# EAGLE design Aerospark v0.0 (EAGLE 6.6.0)
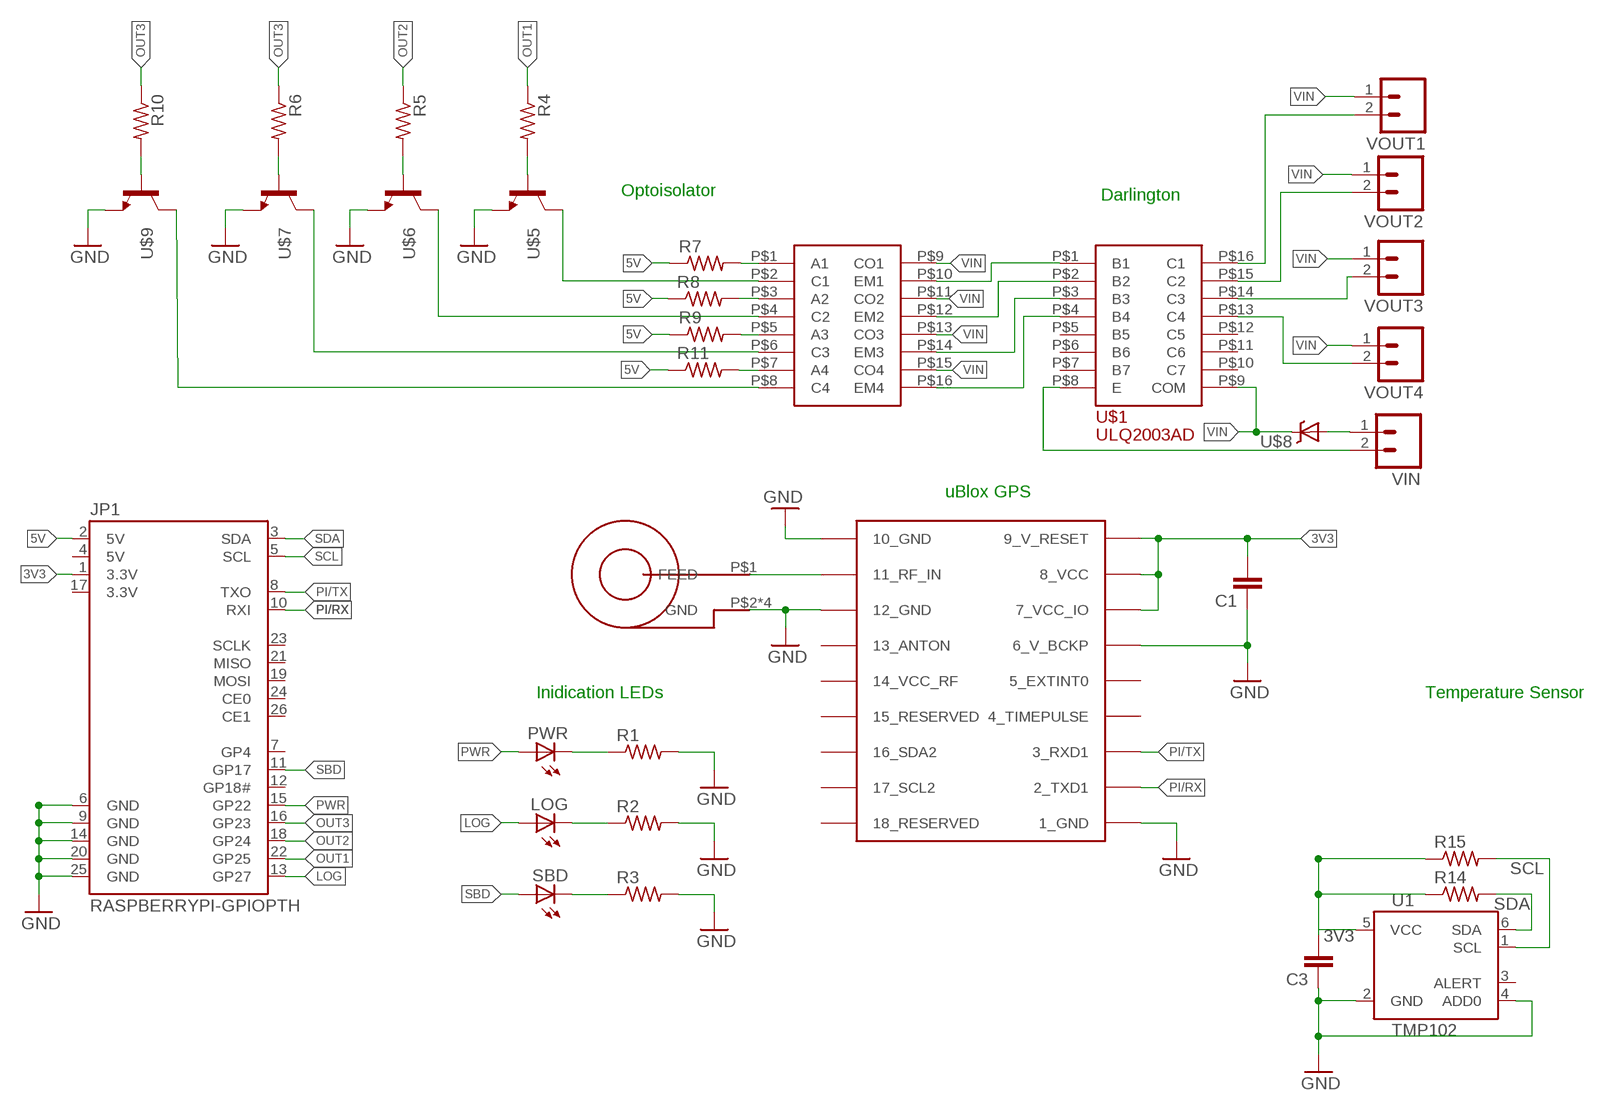
[diagram p0: schematic, sheet 1]

## Parts
C1  CAP0805  [0805]
C3  CAP0805  [0805]
JP1  RASPBERRYPI-GPIOPTH  [2X13-SHROUDED]
LOG  LEDCHIPLED_0805  [CHIPLED_0805]
PWR  LEDCHIPLED_0805  [CHIPLED_0805]
R1  R-US_R0805  [R0805]
R2  R-US_R0805  [R0805]
R3  R-US_R0805  [R0805]
R4  R-US_R0805  [R0805]
R5  R-US_R0805  [R0805]
R6  R-US_R0805  [R0805]
R7  R-US_R0805  [R0805]
R8  R-US_R0805  [R0805]
R9  R-US_R0805  [R0805]
R10  R-US_R0805  [R0805]
R11  R-US_R0805  [R0805]
R14  R-US_R0805  [R0805]
R15  R-US_R0805  [R0805]
SBD  LEDCHIPLED_0805  [CHIPLED_0805]
U1  TMP102  [SOT563]
U$1  ULQ2003A  [SOIC]
U$2  UBLOX_MAX  [UBLOX_MAX]
U$3  JDGA-REMQV-ANTENNA  [JDGA-RIGID_COMBO_PAD]
U$5  MMBT3904FSCT-ND  [SOT-23]
U$6  MMBT3904FSCT-ND  [SOT-23]
U$7  MMBT3904FSCT-ND  [SOT-23]
U$8  VISHAY_SCHOTTKY  [DO-220AA]
U$9  MMBT3904FSCT-ND  [SOT-23]
U$11  K847PH  K847PHDIP16  [DIP16]
VIN  M023.5MM_LOCK  [SCREWTERMINAL-3.5MM-2_LOCK]
VOUT1  M023.5MM_LOCK  [SCREWTERMINAL-3.5MM-2_LOCK]
VOUT2  M023.5MM_LOCK  [SCREWTERMINAL-3.5MM-2_LOCK]
VOUT3  M023.5MM_LOCK  [SCREWTERMINAL-3.5MM-2_LOCK]
VOUT4  M023.5MM_LOCK  [SCREWTERMINAL-3.5MM-2_LOCK]

## Nets
3V3: C1.2 C3.2 JP1.1(3.3V) R14.1 R15.1 U1.5(VCC) U$2.7_VCC_IO U$2.8_VCC U$2.9_V_RESET
5V: JP1.2(5V) R7.1 R8.1 R9.1 R11.1
GND: C1.1 C3.1 JP1.6(GND) JP1.9(GND) JP1.14(GND) JP1.20(GND) JP1.25(GND) R1.2 R2.2 R3.2 U1.2(GND) U1.4(ADD0) U$2.1_GND U$2.6_V_BCKP U$2.10_GND U$2.12_GND U$3.P$2(GND) U$3.P$3(GND) U$3.P$4(GND) U$3.P$5(GND) U$5.3(E) U$6.3(E) U$7.3(E) U$9.3(E)
LOG: JP1.13(GP27) LOG.A
N$1: U$2.11_RF_IN U$3.P$1(FEED)
N$2: R7.2 U$11.P$1(A1)
N$3: PWR.C R1.1
N$4: LOG.C R2.1
N$5: R3.1 SBD.C
N$6: R8.2 U$11.P$3(A2)
N$7: R9.2 U$11.P$5(A3)
N$8: U$1.P$16(C1) VOUT1.2
N$10: U$5.2(C) U$11.P$2(C1)
N$11: U$1.P$1(B1) U$11.P$10(EM1)
N$12: U$6.2(C) U$11.P$4(C2)
N$13: U$7.2(C) U$11.P$6(C3)
N$14: U$1.P$8(E) VIN.2
N$15: R4.2 U$5.1(B)
N$16: R5.2 U$6.1(B)
N$17: R6.2 U$7.1(B)
N$18: U$8.ANODE(A) VIN.1
N$20: U$1.P$15(C2) VOUT2.2
N$21: U$1.P$14(C3) VOUT3.2
N$22: U$1.P$13(C4) VOUT4.2
N$23: U$1.P$3(B3) U$11.P$14(EM3)
N$25: U$1.P$2(B2) U$11.P$12(EM2)
N$27: R10.2 U$9.1(B)
N$28: U$9.2(C) U$11.P$8(C4)
N$29: R11.2 U$11.P$7(A4)
N$30: U$1.P$4(B4) U$11.P$16(EM4)
OUT1: JP1.22(GP25) R4.1
OUT2: JP1.18(GP24) R5.1
OUT3: JP1.16(GP23) R6.1 R10.1
PI/RX: JP1.10(RXI) U$2.2_TXD1
PI/TX: JP1.8(TXO) U$2.3_RXD1
PWR: JP1.15(GP22) PWR.A
SBD: JP1.11(GP17) SBD.A
SCL: JP1.5(SCL) R15.2 U1.1(SCL)
SDA: JP1.3(SDA) R14.2 U1.6(SDA)
VIN: U$1.P$9(COM) U$8.CATHODE(C) U$11.P$9(CO1) U$11.P$11(CO2) U$11.P$13(CO3) U$11.P$15(CO4) VOUT1.1 VOUT2.1 VOUT3.1 VOUT4.1
Unconnected: JP1.7(GP4) JP1.12(GP18#) JP1.19(MOSI) JP1.21(MISO) JP1.23(SCLK) JP1.24(CE0) JP1.26(CE1) U1.3(ALERT) U$1.P$5(B5) U$1.P$6(B6) U$1.P$7(B7) U$1.P$10(C7) U$1.P$11(C6) U$1.P$12(C5) U$2.4_TIMEPULSE U$2.5_EXTINT0 U$2.13_ANTON U$2.14_VCC_RF U$2.15_RESERVED U$2.16_SDA2 U$2.17_SCL2 U$2.18_RESERVED

## Notes on the sheet
- Optoisolator | Darlington
- uBlox GPS
- Inidication LEDs | Temperature Sensor

## Power pins joined to a net without a drawn wire
3.3V: JP1.17(3.3V)
5V: JP1.4(5V)

## Library data of the parts
C1 C3 = SparkFun-Capacitors:CAP: Capacitor Standard 0603 ceramic capacitor, and 0.1" leaded capacitor.; OC_NEWARK: unknown
JP1 = SparkFun-Boards:RASPBERRYPI-GPIO: RASPBERRY PI I/O HEADER As defined for the Revistion 2 Pi.; DIST: sparkfun; DIST_ID: PRT-11490; OC_NEWARK: unknown
LOG PWR SBD = led:LED: LED OSRAM: - CHIPLED LG R971, LG N971, LY N971, LG Q971, LY Q971, LO R971, LY R971 LH N974, LH R974 LS Q976, LO Q976, LY Q976 LO Q996 - Hyper CHIPLED LW Q18S LB Q993, LB Q99A, LB R99A - SideLED LS A670, LO A670, LY A670, LG A670, LP A670 LB A673, LV A673, LT A673, LW A673 LH A674 LY A675 LS A676, LA A676, LO A676, LY A676, LW A676 LS A679, LY A679, LG A679 - Hyper Micro SIDELED® LS Y876, LA Y876, LO Y876, LY Y876 LT Y87S - SmartLED LW L88C, LW L88S LB L89C, LB L89S, LG L890 LS L89K, LO L89K, LY L89K LS L896, LA L896, LO L896, LY L896 - TOPLED LS T670, LO T670, LY T670, LG T670, LP T670 LSG T670, LSP T670, LSY T670, LOP T670, LYG T670 LG T671, LOG T671, LSG T671 LB T673, LV T673, LT T673, LW T673 LH T674 LS T676, LA T676, LO T676, LY T676, LB T676, LH T676, LSB T676, LW T676 LB T67C, LV T67C, LT T67C, LS T67K, LO T67K, LY T67K, LW E67C LS E67B, LA E67B, LO E67B, LY E67B, LB E67C, LV E67C, LT E67C LW T67C LS T679, LY T679, LG T679 LS T770, LO T770, LY T770, LG T770, LP T770 LB T773, LV T773, LT T773, LW T773 LH T774 LS E675, LA E675, LY E675, LS T675 LS T776, LA T776, LO T776, LY T776, LB T776 LHGB T686 LT T68C, LB T68C - Hyper Mini TOPLED® LB M676 - Mini TOPLED Santana® LG M470 LS M47K, LO M47K, LY M47K Source: http://www.osram.convergy.de LUXEON: - LUMILED® LXK2-PW12-R00, LXK2-PW12-S00, LXK2-PW14-U00, LXK2-PW14-V00 LXK2-PM12-R00, LXK2-PM12-S00, LXK2-PM14-U00 LXK2-PE12-Q00, LXK2-PE12-R00, LXK2-PE12-S00, LXK2-PE14-T00, LXK2-PE14-U00 LXK2-PB12-K00, LXK2-PB12-L00, LXK2-PB12-M00, LXK2-PB14-N00, LXK2-PB14-P00, LXK2-PB14-Q00 LXK2-PR12-L00, LXK2-PR12-M00, LXK2-PR14-Q00, LXK2-PR14-R00 LXK2-PD12-Q00, LXK2-PD12-R00, LXK2-PD12-S00 LXK2-PH12-R00, LXK2-PH12-S00 LXK2-PL12-P00, LXK2-PL12-Q00, LXK2-PL12-R00 Source: www.luxeon.com KINGBRIGHT: KA-3528ASYC Source: www.kingbright.com; OC_NEWARK: unknown
R1-R3 = resistor:R-US_: RESISTOR, American symbol; MF: SLI (CML/IDI); MPN: CMD17-21VGD/TR8; OC_NEWARK: 34C8662
R4-R11 R14 R15 = resistor:R-US_: RESISTOR, American symbol
U1 = SparkFun-Sensors:TMP102: I2C degC temp sensor
U$1 = ULQ2003AD:ULQ2003A
U$2 = Ava:UBLOX_MAX: UBLOX MAX; OC_NEWARK: unknown
U$3 = Ava:JDGA-REMQV-ANTENNA
U$5-U$7 U$9 = GuShH:MMBT3904
U$8 = Ava:VISHAY_SCHOTTKY: VISHAY - SS2P3-M3/84A - DIODE, RECTIFIER, SCHOTTKY, 2A, 30V, SMP Farnell 1812484
U$11 = K847PH:K847PH
VIN VOUT1-VOUT4 = SparkFun-Connectors:M02: Standard 2-pin 0.1" header. Use with - straight break away headers ( PRT-00116) - right angle break away headers (PRT-00553) - swiss pins (PRT-00743) - machine pins (PRT-00117) - female headers (PRT-00115) Molex polarized connector foot print use with: PRT-08233 with associated crimp pins and housings. 2.54_SCREWTERM for use with PRT-10571. 3.5mm Screw Terminal footprints for PRT-08084 5mm Screw Terminal footprints for use with PRT-08433; OC_NEWARK: unknown

## Net classes
0 default: width 0.203 mm, drill 0.381 mm, clearance 0.203 mm

## Board
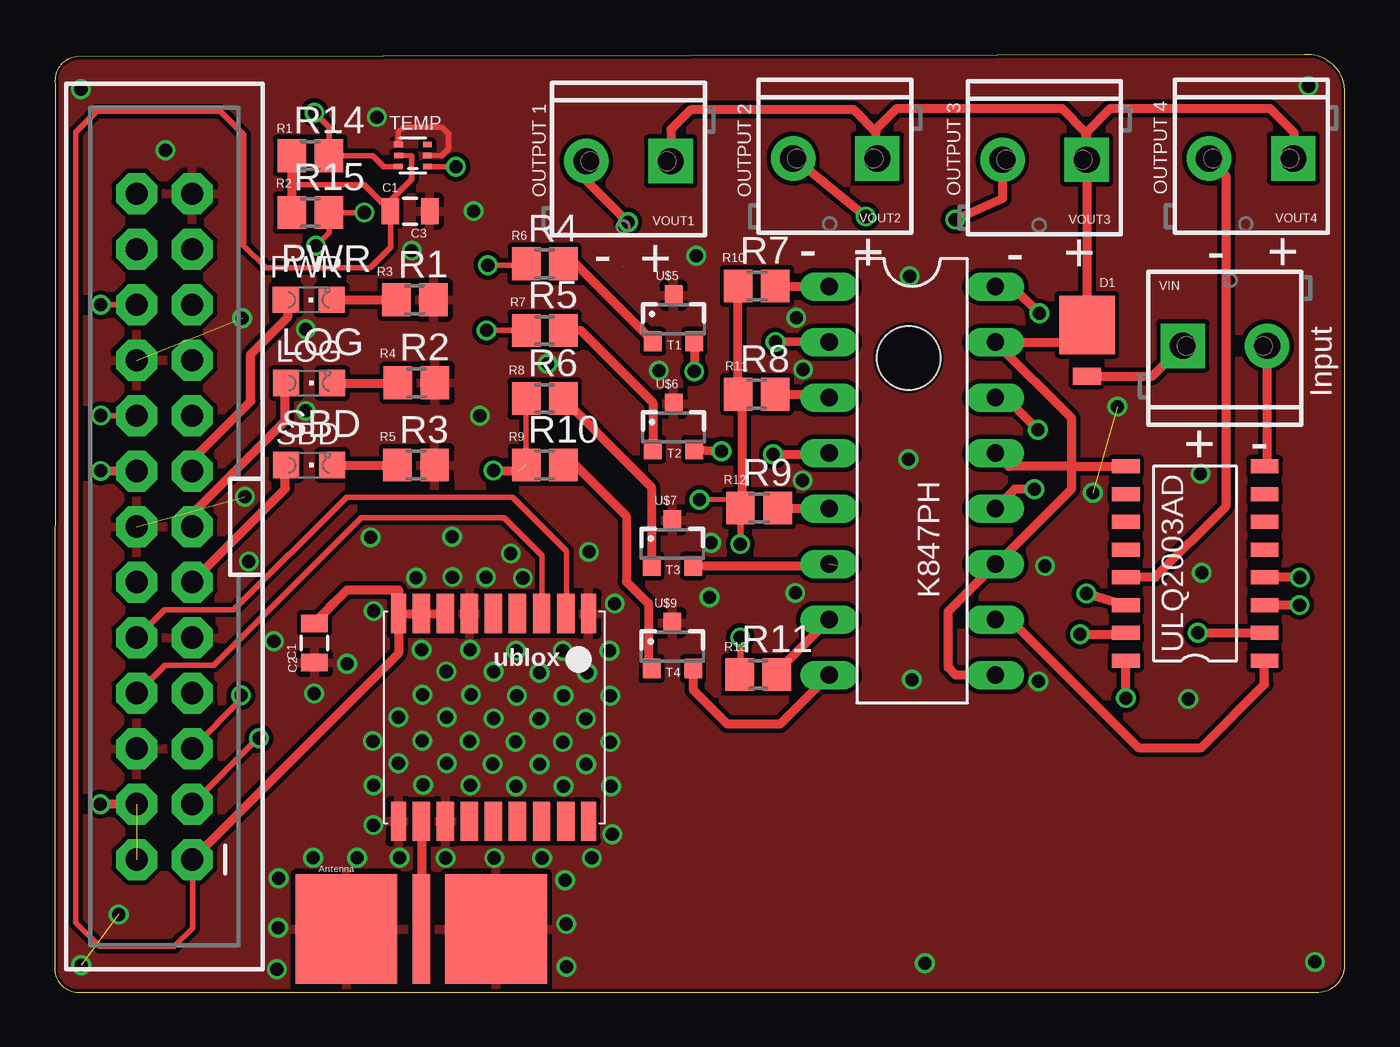
[diagram p1: board, top side]
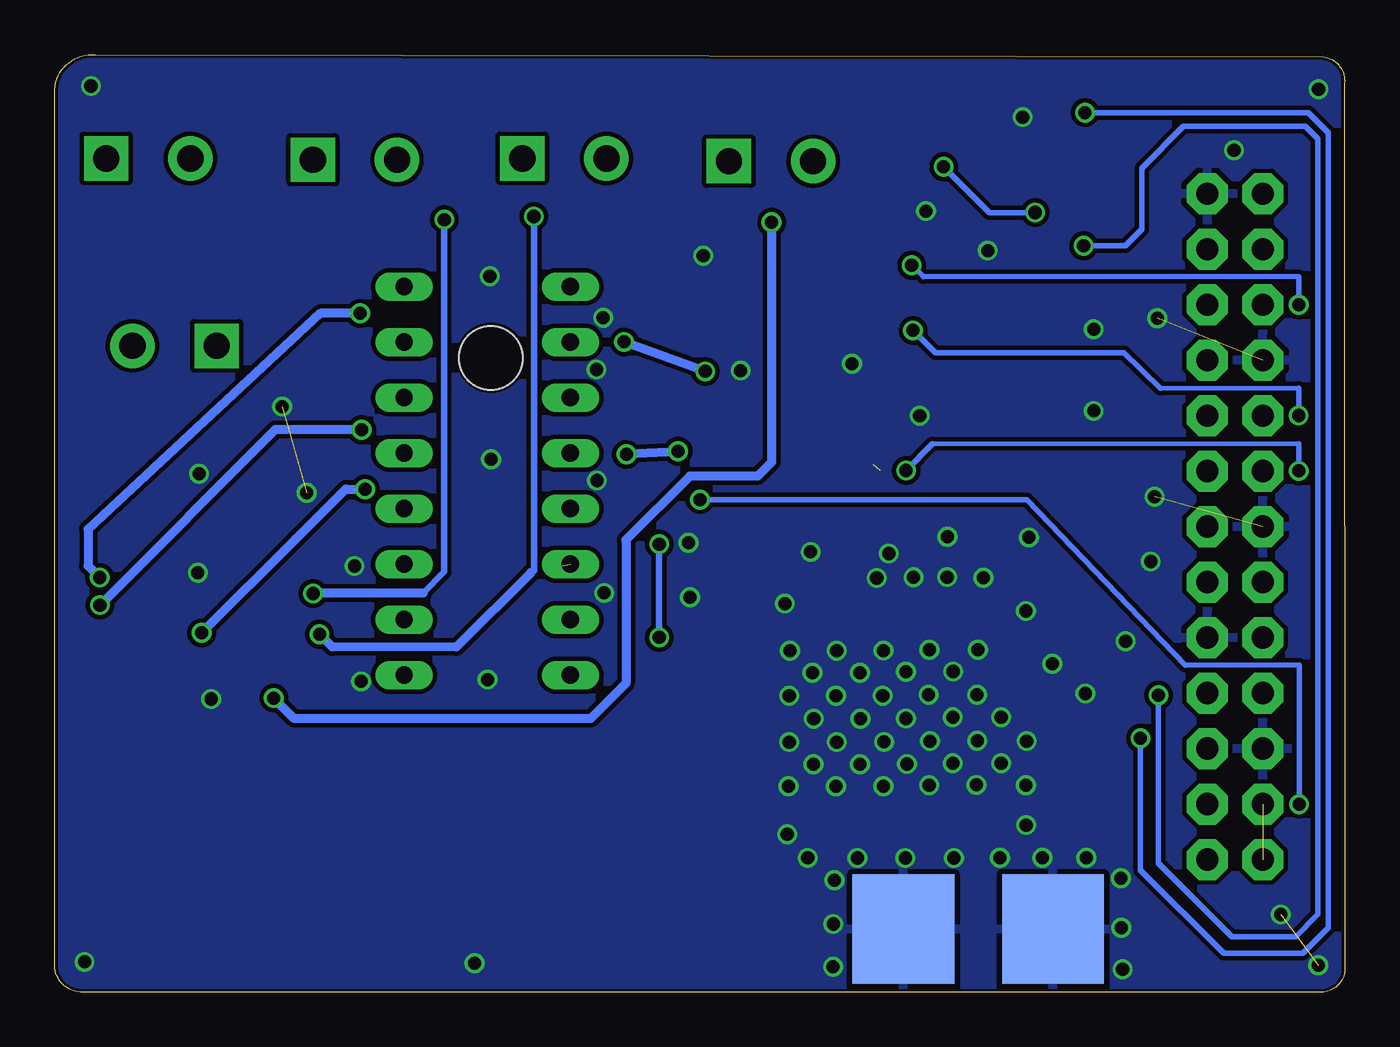
[diagram p2: board, bottom side, seen from below]

Size 59.08 x 42.92 mm. Coordinates in mm from the lower left corner, seen from the top.
Outline: 0.02,41.6 0,1.03 arc90 1.18,0 57.88,0 arc90 59.08,1.33 59.08,41.33 arc90 57.22,42.91 0.99,42.81 arc90 0.02,41.6
Copper layers (1*16): Top 0.035mm / dielectric 1.5mm / Bottom 0.035mm
Design rules "Hackvana": minimum track width 6mil, minimum drill 0.3mm, track to track 6mil, track to pad 6mil, pad to pad 6mil, via to via 6mil, smd to smd 0mil, copper to edge 6mil, drill to drill 6mil, minimum pad ring 10mil, minimum via ring 6mil, stop-mask expansion 2mil, vias tented up to drill 100mil, thermal gap 10mil
Holes 2.9 mm at 39.1,29.04

### Footprints (pad centres in the part's own frame; a part is rotated, then mirrored left to right if it is on the bottom)
0805 = smd 0.8 x 1.2: 1 -0.9,0; 2 0.9,0
2X13-SHROUDED = drill 1.016 pad 1.88 octagon: 1 -1.27,15.24; 2 1.27,15.24; 3 -1.27,12.7; 4 1.27,12.7; 5 -1.27,10.16; 6 1.27,10.16; 7 -1.27,7.62; 8 1.27,7.62; 9 -1.27,5.08; 10 1.27,5.08; 11 -1.27,2.54; 12 1.27,2.54; 13 -1.27,0; 14 1.27,0; 15 -1.27,-2.54; 16 1.27,-2.54; 17 -1.27,-5.08; 18 1.27,-5.08; 19 -1.27,-7.62; 20 1.27,-7.62; 21 -1.27,-10.16; 22 1.27,-10.16; 23 -1.27,-12.7; 24 1.27,-12.7; 25 -1.27,-15.24; 26 1.27,-15.24
CHIPLED_0805 = smd 1.2 x 1.2: A 0,-1.05; C 0,1.05
R0805 = smd 1.3 x 1.5: 1 -0.85,0; 2 0.85,0
SOT563 = smd 0.25 x 0.4: 1 -0.5,-0.66; 2 0,-0.66; 3 0.5,-0.66; 4 0.5,0.66; 5 0,0.66; 6 -0.5,0.67
SOIC = smd 1.27 x 0.635: P$1 0,0; P$2 0,-1.27; P$3 0,-2.54; P$4 0,-3.81; P$5 0,-5.08; P$6 0,-6.35; P$7 0,-7.62; P$8 0,-8.89; P$9 6.35,-8.89; P$10 6.35,-7.62; P$11 6.35,-6.35; P$12 6.35,-5.08; P$13 6.35,-3.81; P$14 6.35,-2.54; P$15 6.35,-1.27; P$16 6.35,0
UBLOX_MAX = smd 1.8 x 0.7: 1_GND 4.95,-4.4; 9_V_RESET 4.95,4.3; 10_GND -4.55,4.3; 18_RESERVED -4.55,-4.4 | smd 1.8 x 0.8: 2_TXD1 4.95,-3.35; 3_RXD1 4.95,-2.25; 4_TIMEPULSE 4.95,-1.15; 5_EXTINT0 4.95,-0.05; 6_V_BCKP 4.95,1.05; 7_VCC_IO 4.95,2.15; 8_VCC 4.95,3.25; 11_RF_IN -4.55,3.25; 12_GND -4.55,2.15; 13_ANTON -4.55,1.05; 14_VCC_RF -4.55,-0.05; 15_RESERVED -4.55,-1.15; 16_SDA2 -4.55,-2.25; 17_SCL2 -4.55,-3.35
JDGA-RIGID_COMBO_PAD = smd 0.8 x 5: P$1 0,0 | smd 4.65 x 5: P$2 -3.425,0; P$3 3.425,0 | smd 4.65 x 5 bottom: P$4 -3.425,0; P$5 3.425,0
SOT-23 = smd 0.8 x 0.9: 1 -0.95,-1; 2 0.95,-1; 3 0,1.1
DO-220AA = smd 0.762 x 1.27: ANODE 2.351,0 | smd 2.67 x 2.54: CATHODE 0,0
DIP16 = drill 0.8 long: P$1 0,0; P$2 0,-2.54; P$3 0,-5.08; P$4 0,-7.62; P$5 0,-10.16; P$6 0,-12.7; P$7 0,-15.24; P$8 0,-17.78; P$9 7.62,-17.78; P$10 7.62,-15.24; P$11 7.62,-12.7; P$12 7.62,-10.16; P$13 7.62,-7.62; P$14 7.62,-5.08; P$15 7.62,-2.54; P$16 7.62,0
SCREWTERMINAL-3.5MM-2_LOCK = drill 1.2 pad 2.032 square: 1 -0.178,0 | drill 1.2 pad 2.032: 2 3.678,0

### Placement (x,y rotation side)
C1  11.9,15.99 90 top
C3  16.28,35.75 180 top
JP1  5.03,21.31 180 top
LOG  11.65,27.88 270 top
PWR  11.64,31.69 270 top
R1  16.49,31.69 0 top
R2  16.57,27.9 0 top
R3  16.55,24.13 0 top
R4  22.44,33.34 0 top
R5  22.44,30.29 0 top
R6  22.44,27.18 0 top
R7  32.15,32.32 0 top
R8  32.15,27.37 0 top
R9  32.25,22.16 0 top
R10  22.44,24.13 0 top
R11  32.22,14.54 0 top
R14  11.71,38.29 0 top
R15  11.71,35.69 0 top
SBD  11.65,24.13 270 top
U1  16.41,38.29 90 top
U$1  55.4,15.18 180 top
U$2  20.05,12.38 90 top
U$3  16.79,2.89 180 top
U$5  28.35,30.8 0 top
U$6  28.35,25.85 0 top
U$7  28.28,20.51 0 top
U$8  47.27,30.55 270 top
U$9  28.28,15.81 0 top
U$11  35.46,32.3 0 top
VIN  51.84,29.59 0 top
VOUT1  28.03,38.04 180 top
VOUT2  37.49,38.17 180 top
VOUT3  47.08,38.1 180 top
VOUT4  56.54,38.17 180 top

### Tracks (layer width: path | path; a pad name or v marks a point on that pad's centre or on a via)
3V3
  Top 0.229: 16.35,38.29 U1.5
  Top 0.254: R15.1 10.86,36.94 10.88,36.96 14.18,36.96 C3.2 | C3.2 15.38,36.25 16.35,37.21 16.35,38.29 | C3.2 15.38,34.09 14.44,33.15 9.68,33.15 8.66,34.17 8.66,39.25 7.58,40.33 1.93,40.33 0.98,39.37 0.98,3.18 2.06,2.1 5.49,2.1 6.31,2.92 6.31,6.06 JP1.1
  Top 0.406: U$2.9_V_RESET U$2.8_VCC U$2.7_VCC_IO | U$2.9_V_RESET 15.75,15.52 JP1.1 | C1.2 12.82,17.84 13.38,18.41 15.74,18.41 U$2.9_V_RESET | R14.1 R15.1
5V  (via drill 0.6)  (1 unrouted)
  Top 0.254: v29.53,22.54 31.42,22.57 R9.1
  Top 0.305: R9.1 31.4,20.47 v31.39,20.51 | v31.39,16.24 31.39,14.52 R11.1
  Top 0.406: R7.1 31.3,32.2 R8.1 31.27,27.11 31.37,27.11 31.48,26.99 31.48,22.57 R9.1 | JP1.4 2.54,8.61 v2.1,8.61
  Bottom 0.229: 2.1,14.97 7.31,14.97 | 7.31,14.97
  Bottom 0.254: v2.1,8.61 2.1,14.97 | 7.31,14.97 14.57,22.54 v29.53,22.54
  Bottom 0.305: v31.39,20.51 v31.39,16.24
GND  (via drill 0.6)  (5 unrouted)
  Top 0.229: U1.4 | 17.73,38.3 U1.2
  Top 0.254: U1.4 15.73,38.79 15.73,39.35 15.98,39.6 17.75,39.6 18.04,39.31 18.04,38.61 17.73,38.3
  other vias: 11.88,13.67 14.61,17.45 14.47,20.82 18.21,20.84 20.89,20.08 24.46,20.15 21.14,9.43 19.03,9.47 16.87,9.49 14.59,7.65 14.61,9.47 10.18,1.05 10.24,2.95 11.84,6.16 13.85,6.16 22.32,6.14 23.37,5.13 23.43,3.12 1.22,1.23 1.21,41.33 18.21,19 10.04,16.07 17.91,6.14 20.13,6.14 23.43,1.16 15.8,6.16 10.26,5.22 23.31,9.42 25.48,9.42 25.54,7.23 24.6,6.15 25.65,17.79 21.44,18.96 19.75,18.99 16.55,18.98 13.4,15.04 21.1,11.46 19,11.5 16.83,11.51 14.57,11.5 23.27,11.45 25.44,11.45 22.2,10.44 20.06,10.45 15.74,10.48 17.96,10.48 24.34,10.44 22.2,14.63 20.1,14.66 17.94,14.68 24.38,14.62 23.27,15.63 21.13,15.64 16.81,15.68 19.03,15.68 25.41,15.63 23.31,13.57 21.16,13.58 16.84,13.61 19.06,13.61 25.44,13.57 22.18,12.52 20.1,12.53 15.74,12.58 17.96,12.58 24.32,12.52 33.96,30.87 34.27,28.5 22.57,28.77 30.06,20.58 27.67,28.45 34.25,23.42 39.25,14.31 48.66,26.81 45.05,14.23 52.52,19.21 57.42,41.48 29.99,18.07 33.91,18.28 29.38,33.71 8.58,30.86 19.18,35.75 8.71,22.68 14.76,40.06 47.54,22.86 45.35,19.51 39.85,1.32 57.71,1.39 8.89,19.72 11.5,30.35 11.5,26.61 19.47,26.39 5.08,38.54 16.36,33.95 51.91,13.42 52.47,23.73 39.1,24.39 39.15,32.77 2.93,3.56
  pour Top: -0.99,42.99 -0.99,-0.51 59.97,-0.51 59.97,42.99
  pour Bottom: -0.99,42.99 -0.99,-0.51 59.97,-0.51 59.97,42.99
LOG
  Top 0.406: JP1.13 6.3,21.9 10.57,26.16 10.57,27.85 LOG.A
N$1
  Top 0.406: U$2.11_RF_IN 16.81,3.12 U$3.P$1
N$2
  Top 0.406: R7.2 35.46,32.32 U$11.P$1
N$3
  Top 0.406: PWR.C R1.1 | R1.1
N$4
  Top 0.406: LOG.C 15.7,27.88 R2.1
N$5
  Top 0.406: SBD.C R3.1 | R3.1
N$6
  Top 0.406: R8.2 35.46,27.37 U$11.P$3
N$7
  Top 0.406: R9.2 35.43,22.16 U$11.P$5
N$8  (via drill 0.6)
  Top 0.406: VOUT1.2 24.35,37.14 v26.25,35.25 | v49.05,13.46 U$1.P$16
  Bottom 0.406: v26.25,35.25 26.25,24.26 26.89,23.62 30,23.62 32.92,20.7 32.92,14.14 34.53,12.52 48.11,12.52 v49.05,13.46
N$10  (via drill 0.6)
  Top 0.406: v33,29.77 35.46,29.79 U$11.P$2 | U$5.2 29.3,28.43 v29.29,28.42
  Bottom 0.406: v29.29,28.42 v33,29.77
N$11
  Top 0.406: U$11.P$10 43.75,17.06 49.61,11.2 52.51,11.2 55.4,14.09 U$1.P$1
N$12  (via drill 0.6)
  Top 0.406: U$6.2 30.33,24.77 v30.54,24.76 | v32.9,24.62 35.46,24.62 U$11.P$4
  Bottom 0.406: v30.54,24.76 30.53,24.73 v32.9,24.62
N$13  (1 unrouted)
  Top 0.406: U$7.2 35.86,19.51
N$14
  Top 0.406: 55.45,24.12 U$1.P$8 55.51,24.19 VIN.2
N$15
  Top 0.406: R4.2 23.86,33.34 U$5.1
N$16
  Top 0.406: R5.2 24.09,30.29 27.39,26.99 U$6.1
N$17
  Top 0.406: R6.2 26.38,24.07 27.33,23.12 U$7.1
N$18
  Top 0.406: U$8.ANODE 50.27,28.2 VIN.1
N$20  (via drill 0.6)
  Top 0.406: VOUT2.2 33.87,38.17 v37.14,35.51 | v46.95,16.39 48.98,16.39 U$1.P$15
  Bottom 0.305: v37.14,35.51 37.12,19.28 37.27,19.21
  Bottom 0.406: 37.27,19.21 40.68,15.81 46.36,15.79 v46.95,16.39
N$21  (via drill 0.6)
  Top 0.406: VOUT3.2 43.4,36.33 v41.24,35.37 | v47.24,18.25 U$1.P$14
  Bottom 0.305: v41.24,35.37 41.24,19.24 42.21,18.27
  Bottom 0.406: 42.21,18.27 v47.24,18.25
N$22
  Top 0.406: VOUT4.2 53.62,37.4 53.62,22.23 50.38,18.99 U$1.P$13
N$23  (via drill 0.6)
  Top 0.406: U$11.P$14 43.55,27.22 v45.02,25.75 | v57,17.72 U$1.P$3
  Bottom 0.406: v45.02,25.75 48.98,25.75 v57,17.72
N$25  (via drill 0.6)
  Top 0.406: v52.35,16.45 U$1.P$2 | v44.86,23.03 43.97,23.03 U$11.P$12
  Bottom 0.406: v52.35,16.45 48.05,20.74 45.75,23.03 v44.86,23.03
N$27
  Top 0.406: R10.2 23.84,24.13 26.19,21.78 26.19,18.8 27.2,17.78 27.2,14.94 U$9.1
N$28
  Top 0.406: U$9.2 29.23,13.85 30.8,12.29 33.23,12.29 U$11.P$8
N$29
  Top 0.406: R11.2 33.07,14.67 U$11.P$7
N$30  (via drill 0.6)
  Top 0.406: U$11.P$16 43.86,32.3 v45.09,31.07 | v57.01,18.98 U$1.P$4
  Bottom 0.406: v45.09,31.07 46.91,31.07 57.55,21.2 57.55,19.52 v57.01,18.98
OUT1  (via drill 0.6)
  Top 0.254: JP1.22 2.71,31.47 v2.11,31.46 | v19.84,33.28 21.53,33.28 R4.1
  Bottom 0.229: 2.12,32.74 19.3,32.74 v19.84,33.28
  Bottom 0.254: v2.11,31.46 2.12,32.74
OUT2  (via drill 0.6)
  Top 0.254: JP1.18 2.36,26.39 v2.12,26.4 | v19.77,30.29 R5.1
  Bottom 0.203: 2.12,27.65 8.45,27.65
  Bottom 0.254: v2.12,26.4 2.12,27.65 | 8.45,27.65 10.12,29.28 18.76,29.28 v19.77,30.29
OUT3  (via drill 0.6)  (1 unrouted)
  Top 0.254: R10.1 R6.1
  Top 0.406: JP1.16 2.29,23.85 v2.11,23.86 | v20.09,23.88 21.27,23.88
  Bottom 0.203: 2.11,25.1 18.88,25.1
  Bottom 0.254: v2.11,23.86 2.11,25.1 | 18.88,25.1 v20.09,23.88
PI/RX
  Top 0.254: JP1.10 4.94,17.41 4.95,17.41 5.03,17.5 | U$2.2_TXD1 23.44,18.46 23.44,20.19 20.97,22.66 13.37,22.66 8.2,17.5 8.19,17.5 5.04,17.5 5.03,17.5 | 5.03,17.5
PI/TX
  Top 0.254: JP1.8 3.78,13.69 5.01,14.93 | 5.01,14.93 | 5.01,14.93 5.05,14.96 7.28,14.96 14.04,21.72 20.57,21.72 22.32,19.97 22.32,18.44 U$2.3_RXD1
PWR
  Top 0.406: JP1.15 6.3,24.37 8.98,27.05 8.98,29.21 10.69,30.93 10.69,31.67 PWR.A
SBD
  Top 0.406: JP1.11 6.3,18.79 10.57,23.05 10.57,24.09 SBD.A
SCL  (via drill 0.6)
  Top 0.254: v14.19,35.69 R15.2 12.56,34.76 v11.96,34.17 | v18.38,37.79 U1.1 | v8.53,13.59 8.6,13.45 JP1.5
  Bottom 0.254: v14.19,35.69 16.28,35.69 v18.38,37.79 | v11.96,34.17 10.06,34.17 9.3,34.93 9.3,37.72 7.39,39.63 1.8,39.63 1.24,39.07 1.24,3.56 2.25,2.54 5.17,2.54 8.53,5.91 v8.53,13.59
SDA  (via drill 0.6)
  Top 0.254: U1.6 15.08,37.79 14.57,38.29 R14.2 12.56,39.6 v11.9,40.26 | v9.36,11.62 9.31,11.62 JP1.3
  Bottom 0.254: v11.9,40.26 1.68,40.26 0.76,39.34 0.76,2.95 1.93,1.78 5.55,1.78 9.36,5.59 v9.36,11.62
VIN
  Top 0.254: VOUT2.1 37.67,38.18
  Top 0.406: 47.21,39.37 46.13,40.45 38.57,40.45 37.62,39.5 37.62,39.37 | 47.21,39.37 47.21,38.15 VOUT3.1 | VOUT3.1 47.26,30.56 | 47.26,30.56 U$8.CATHODE 46.48,29.76 U$11.P$15 46.57,26.27 46.57,24.07 | 47.26,30.56 46.9,30.56 | 46.57,24.07 U$1.P$9 | VOUT3.1 47.26,39.32 47.21,39.37 | 47.21,39.37 47.27,39.37 48.35,40.45 55.65,40.45 56.73,39.37 56.73,38.18 VOUT4.1 | VOUT2.1 37.62,38.22 37.62,39.37 | 37.62,39.37 36.6,40.39 29.11,40.39 28.22,39.5 28.22,38.05 VOUT1.1 | U$11.P$9 41.26,14.52 40.92,14.87 40.92,17.44 U$11.P$11 43.12,19.6 46.57,23.05 46.57,24.07 | 46.57,24.07 43.69,24.07 U$11.P$13

### Text on the board
tPlace: R1 | TEMP | R2 | C1 | OUTPUT 1 | OUTPUT 2 | OUTPUT 3 | OUTPUT 4 | R6 | R10 | - | + | - | + | PWR | R3 | - | + | - | + | D1 | R7 | R4 | T1 | LOG | R8 | R11 | Input | SBD | R5 | R9 | T2 | + | - | R12 | T3 | K847PH | R13 | ULQ2003AD | C2 | T4 | Antenna